# Altium schematic sheet PM_HDMI_CON.SchDoc: Title
size 420 x 297 mm; Author: G.Kasprowicz; CompanyName: WUT ISE; DrawnBy: G.Kasprowicz; Organization: WUT ISE; Address1: PW ISE; Address2: Nowowiejska 15/19 00-665 Warsaw; Address3: gkasprow@gmail.com; Revision: 2; SheetNumber: -; SheetTotal: -; ModifiedBy: -; CheckedDate: -; Title2: Title 2; DivGrp: WUT ISE; Designer: G.Kasprowicz; ModifiedDate: -; ProjectName: Sensor Box
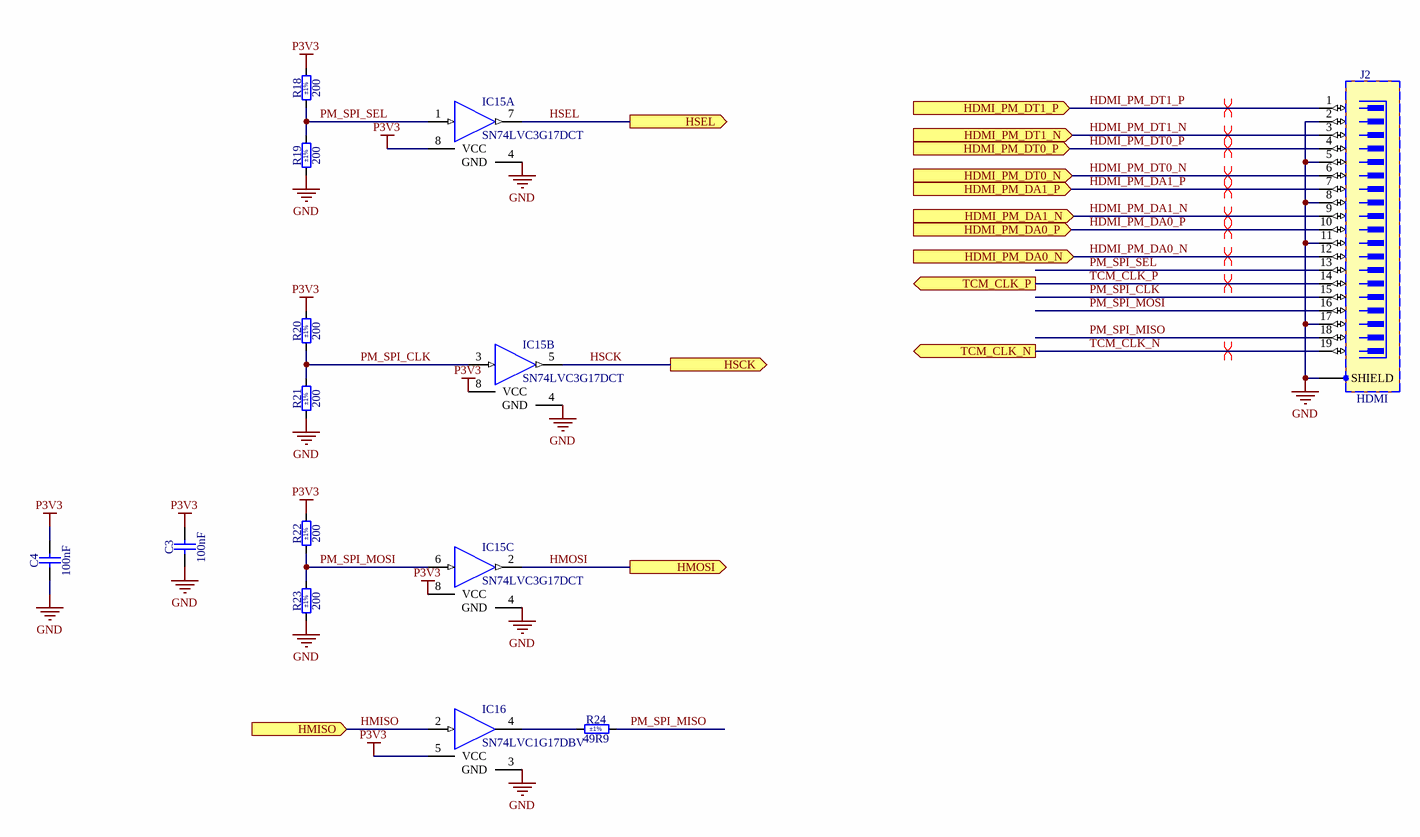
[diagram p0: PM_HDMI_CON.SchDoc]

## Parts
C3  100nF  [CAPC1005X55N]
C4  100nF  [CAPC1005X55N]
IC15  SN74LVC3G17DCT  [SOP65P400X130-8N]  (parts A,B,C of 3)
IC16  SN74LVC1G17DBV  [SOT95P280X145-5N]
J2  HDMI  [TYCO_2007435-1]
R18  200  Tolerance: ±1%  [RESC1608X55N]
R19  200  Tolerance: ±1%  [RESC1608X55N]
R20  200  Tolerance: ±1%  [RESC1608X55N]
R21  200  Tolerance: ±1%  [RESC1608X55N]
R22  200  Tolerance: ±1%  [RESC1608X55N]
R23  200  Tolerance: ±1%  [RESC1608X55N]
R24  49R9  Tolerance: ±1%  [RESC1005X40N]

## Ports
HDMI_PM_DA0_N (in), HDMI_PM_DA0_P (in), HDMI_PM_DA1_N (in), HDMI_PM_DA1_P (in), HDMI_PM_DT0_N (in), HDMI_PM_DT0_P (in), HDMI_PM_DT1_N (in), HDMI_PM_DT1_P (in), HMISO (in), HMOSI (out), HSCK (out), HSEL (out), TCM_CLK_N (out), TCM_CLK_P (out)

## Nets
GND: C3.1 C4.1 IC15.4(GND) IC16.3(GND) J2.2 J2.5 J2.8 J2.11 J2.17 J2.SHIELD R19.1 R21.1 R23.1
P3V3: C3.2 C4.2 IC15.8(VCC) IC16.5(VCC) R18.2 R20.2 R22.2
HDMI_PM_DA0_N: J2.12 ; port HDMI_PM_DA0_N
HDMI_PM_DA0_P: J2.10 ; port HDMI_PM_DA0_P
HDMI_PM_DA1_N: J2.9 ; port HDMI_PM_DA1_N
HDMI_PM_DA1_P: J2.7 ; port HDMI_PM_DA1_P
HDMI_PM_DT0_N: J2.6 ; port HDMI_PM_DT0_N
HDMI_PM_DT0_P: J2.4 ; port HDMI_PM_DT0_P
HDMI_PM_DT1_N: J2.3 ; port HDMI_PM_DT1_N
HDMI_PM_DT1_P: J2.1 ; port HDMI_PM_DT1_P
HMISO: IC16.2(IN) ; port HMISO
HMOSI: IC15.2(OUT) ; port HMOSI
HSCK: IC15.5(OUT) ; port HSCK
HSEL: IC15.7(OUT) ; port HSEL
PM_SPI_CLK: IC15.3(IN) J2.15 R20.1 R21.2
PM_SPI_MISO: J2.18 R24.2
PM_SPI_MOSI: IC15.6(IN) J2.16 R22.1 R23.2
PM_SPI_SEL: IC15.1(IN) J2.13 R18.1 R19.2
TCM_CLK_N: J2.19 ; port TCM_CLK_N
TCM_CLK_P: J2.14 ; port TCM_CLK_P
NetIC16_4: IC16.4(OUT) R24.1

## Layout directives
differential pair: HDMI_PM_DA0_N, HDMI_PM_DA0_P, HDMI_PM_DA1_N, HDMI_PM_DA1_P, HDMI_PM_DT0_N, HDMI_PM_DT0_P, HDMI_PM_DT1_N, HDMI_PM_DT1_P, TCM_CLK_N, TCM_CLK_P

## Notes on the sheet
- Project/Equipment
- Document
- Designer
- Drawn by
- Check.by
- Copyright WUT ISE 2024.
  This documentation describes Open Hardware and is licensed under the CERN OHL v.2. You may redistribute and modify this documentation under the terms of the CERN OHL v.2. (http://ohwr.org/CERNOHL). This documentation is distributed WITHOUT ANY EXPRESS OR IMPLIED WARRANTY, INCLUDING OF MERCHANTABILITY, SATISFACTORY QUALITY AND FITNESS FOR A PARTICULAR PURPOSE. Please see the CERN OHL v.2 for applicable conditions.
- Contact
- File
- Last Mod.
- Print Date
- Sheet
- Size
- A3
- of
- Rev

## Library data of the parts
C3 C4 = CC0402_100NF_50V_10%_X7R: Non-polarised capacitor; Part Description: SMD Multilayer Chip Ceramic Capacitor; Manufacturer: GENERIC; Manufacturer1 Part Number: GRM155R71H104KE14D; Voltage: 50V; TC: X7R; Tolerance: ±10%; Part Number: CC0402_100NF_50V_10%_X7R; Component Kind: Standard; Component Type: Standard; Pin Count: 2; Value: 100nF; Status: None; Manufacturer Part Number: CC0402_100NF_50V_10%_X7R; Case: 0402; Mounted: Yes; Socket: No; SMD: Yes; Sense: No; Manufacturer1 Example: MURATA; Manufacturer1 ComponentHeight: 0.55mm; HelpURL: \\cern.ch\dfs\Applications\Altium\Datasheets\CC0402_MURATA_GRM155R71H104KE14D.pdf; Author: CERN DEM MR; CreateDate: 30.06.2017; LatestRevisionDate: 30.06.2017
IC15 = SN74LVC3G17DCT: Triple Schmitt-Trigger Buffer; Manufacturer: TEXAS INSTRUMENTS; PressFit: No; Bonding: No; Part Number: SN74LVC3G17DCT; Component Kind: Standard; Component Type: Standard; Device: SN74LVC3G17DCT; PackageDescription: SOP, 0.65mm Pitch; 8 Pin, 2.80mm W X 2.95mm L X 1.30mm H body, IPC Medium Density; Part Description: Triple Schmitt-Trigger Buffer; Manufacturer Part Number: SN74LVC3G17DCT; Pin Count: 8; Case: TSSOP8; Mounted: Yes; Socket: No; SMD: Yes; Sense: No; ComponentHeight: 1.3mm; Author: CERN DEM HF; HelpURL: \\cern.ch\dfs\Applications\Altium\Datasheets\SN74LVC3G17.pdf; CreateDate: 10.06.2024; LatestRevisionDate: 10.06.2024
IC16 = SN74LVC1G17DBVR: Single Schmitt-Trigger Buffer; Manufacturer: TEXAS INSTRUMENTS; PressFit: No; Bonding: No; Part Number: SN74LVC1G17DBVR; Component Kind: Standard; Component Type: Standard; Device: SN74LVC1G17DBV; PackageDescription: SOT, 0.95mm Pitch; 5 Pin, 1.60mm W X 2.90mm L X 1.45mm H body, IPC Medium Density; Part Description: Single Schmitt-Trigger Buffer; Manufacturer Part Number: SN74LVC1G17DBV; Pin Count: 5; Case: SOT23-5; Mounted: Yes; Socket: No; SMD: Yes; Sense: No; ComponentHeight: 1.45mm; Author: CERN DEM JLC; HelpURL: \\cern.ch\dfs\Applications\Altium\Datasheets\SN74LVC1G17DBVR.pdf; CreateDate: 06.11.2012; LatestRevisionDate: 06.11.2012
J2 = TYCO_2007435-1: Connector HDMI 19 Male + 1 Shield; Part Description: 0.578mm Pitch, Through-Hole Right Angle 19 Contacts Flag-HDMI Type-A Receptacle Thru Hole Mounting Pads; Manufacturer: TYCO ELECTRONICS; PressFit: No; Part Number: TYCO_2007435-1; Component Kind: Standard; Component Type: Standard; Pin Count: 23; Family: HDMI; Mounted: Yes; Socket: No; SMD: No; Sense: No; Status: None; Manufacturer Part Number: 2007435-1; ComponentHeight: 16.4mm; HelpURL: \\cern.ch\dfs\Applications\Altium\Datasheets\TYCO_2007435-1.pdf; Author: CERN DEM MR; CreateDate: 05.07.2016; LatestRevisionDate: 05.07.2016
R18-R23 = R0603_200R_1%_0.1W_100PPM: Resistor - 1%; Part Description: General Purpose Thick Film Chip Resistor; Manufacturer: GENERIC; Manufacturer1 Part Number: NRC06F2000TRF; Power: 0.1W; TC: ±100ppm/°C; PressFit: No; Part Number: R0603_200R_1%_0.1W_100PPM; Component Kind: Standard; Component Type: Standard; Pin Count: 2; Value: 200; Status: Preferred; Manufacturer Part Number: R0603_200R_1%_0.1W_100PPM; Case: 0603; Mounted: Yes; Sense: No; Socket: No; SMD: Yes; Manufacturer1 Example: NIC COMPONENT; Manufacturer1 ComponentHeight: 0.55mm; HelpURL: \\cern.ch\dfs\Applications\Altium\Datasheets\R0603_NIC_NRC.pdf; Author: CERN DEM JLC; CreateDate: 03.12.2007; LatestRevisionDate: 13.03.2008
R24 = R0402_49R9_1%_0.0625W_100PPM: Resistor - 1%; Part Description: General Purpose Thick Film Chip Resistor; Manufacturer: GENERIC; Manufacturer1 Part Number: 232270674999L or RC0402FR-0749R9L; TC: ±100ppm/°C; PressFit: No; Part Number: R0402_49R9_1%_0.0625W_100PPM; Component Kind: Standard; Component Type: Standard; Pin Count: 2; Value: 49R9; Status: Not Recommended; Power: 0.0625W; Manufacturer Part Number: R0402_49R9_1%_0.0625W_100PPM; Case: 0402; Mounted: Yes; Sense: No; Socket: No; SMD: Yes; Manufacturer1 Example: YAGEO PHYCOMP; Manufacturer1 ComponentHeight: 0.4mm; HelpURL: \\cern.ch\dfs\Applications\Altium\Datasheets\R0402_Phycomp_RC0402.pdf; Author: CERN DEM JLC; CreateDate: 24.10.2012; LatestRevisionDate: 24.10.2012